# EAGLE design x15 (EAGLE 7.7.0)
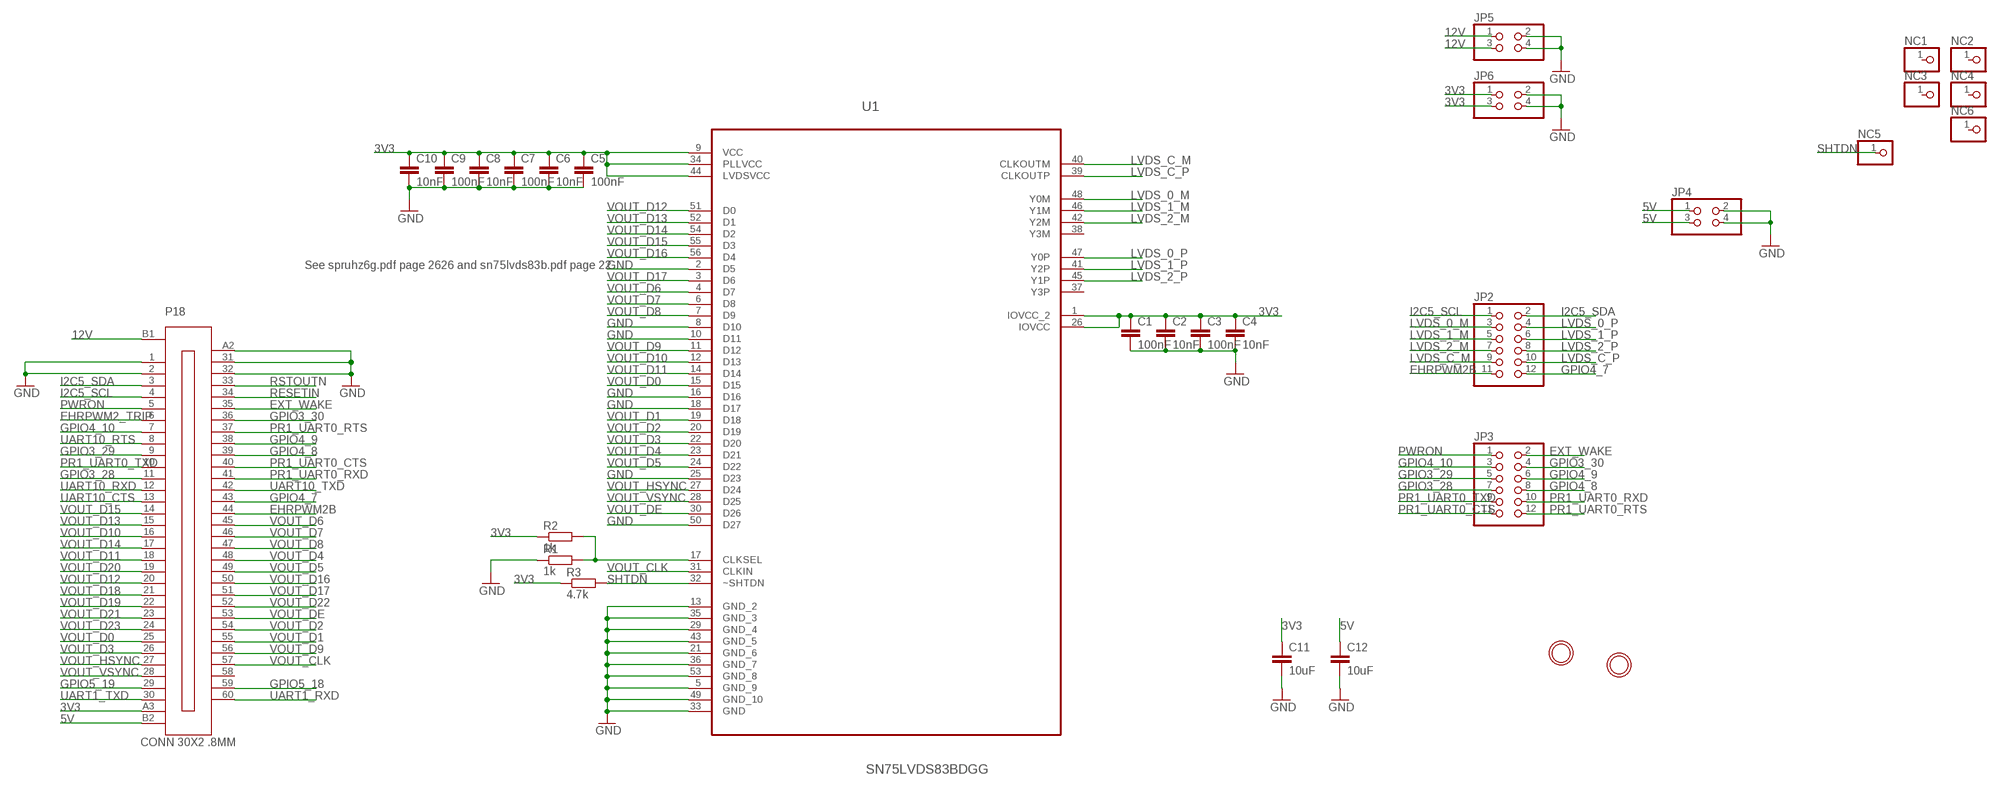
[diagram p0: schematic, sheet 1]

## Parts
C1  100nF  C-EUC0603K  [C0603K]
C2  10nF  C-EUC0603K  [C0603K]
C3  100nF  C-EUC0603K  [C0603K]
C4  10nF  C-EUC0603K  [C0603K]
C5  100nF  C-EUC0603K  [C0603K]
C6  10nF  C-EUC0603K  [C0603K]
C7  100nF  C-EUC0603K  [C0603K]
C8  10nF  C-EUC0603K  [C0603K]
C9  100nF  C-EUC0603K  [C0603K]
C10  10nF  C-EUC0603K  [C0603K]
C11  10uF  C-EUC1206K  [C1206K]
C12  10uF  C-EUC1206K  [C1206K]
JP2  PINHD-2X6  [2X06]
JP3  PINHD-2X6  [2X06]
JP4  PINHD-2X2  [2X02]
JP5  PINHD-2X2  [2X02]
JP6  PINHD-2X2  [2X02]
NC1  PINHD-1X1  [1X01]
NC2  PINHD-1X1  [1X01]
NC3  PINHD-1X1  [1X01]
NC4  PINHD-1X1  [1X01]
NC5  PINHD-1X1  [1X01]
NC6  PINHD-1X1  [1X01]
P18  CONN 30X2 .8MM  CONN_FX18-60S-0.8SV15  [CONN_FX18-60S-0.8SV15]
R1  1k  R-EU_R0603  [R0603]
R2  1k  R-EU_R0603  [R0603]
R3  4.7k  R-EU_R0603  [R0603]
U1  SN75LVDS83BDGG  [SOP50P810X120-56N]
U$1  MOUNTINGHOLE2.5  [MOUNTINGHOLE_2.5_PLATED]
U$2  MOUNTINGHOLE2.5  [MOUNTINGHOLE_2.5_PLATED]

## Nets
3V3: C1.1 C2.1 C3.1 C4.1 C5.1 C6.1 C7.1 C8.1 C9.1 C10.1 C11.1 JP6.1 JP6.3 P18.A3 R2.1 R3.1 U1.1(IOVCC_2) U1.9(VCC) U1.26(IOVCC) U1.34(PLLVCC) U1.44(LVDSVCC)
5V: C12.1 JP4.1 JP4.3 P18.B2
12V: JP5.1 JP5.3 P18.B1
EHRPWM2_TRIP: P18.6
EHRPWM2B: JP2.11 P18.44
EXT_WAKE: JP3.2 P18.35
GND: C1.2 C2.2 C3.2 C4.2 C5.2 C6.2 C7.2 C8.2 C9.2 C10.2 C11.2 C12.2 JP4.2 JP4.4 JP5.2 JP5.4 JP6.2 JP6.4 P18.1 P18.2 P18.31 P18.32 P18.A2 R1.1 U1.2(D5) U1.5(GND_9) U1.8(D10) U1.10(D11) U1.13(GND_2) U1.16(D16) U1.18(D17) U1.21(GND_6) U1.25(D23) U1.29(GND_4) U1.33(GND) U1.35(GND_3) U1.36(GND_7) U1.43(GND_5) U1.49(GND_10) U1.50(D27) U1.53(GND_8)
GPIO3_28: JP3.7 P18.11
GPIO3_29: JP3.5 P18.9
GPIO3_30: JP3.4 P18.36
GPIO4_7: JP2.12 P18.43
GPIO4_8: JP3.8 P18.39
GPIO4_9: JP3.6 P18.38
GPIO4_10: JP3.3 P18.7
GPIO5_18: P18.59
GPIO5_19: P18.29
I2C5_SCL: JP2.1 P18.4
I2C5_SDA: JP2.2 P18.3
LVDS_0_M: JP2.3 U1.48(Y0M)
LVDS_0_P: JP2.4 U1.47(Y0P)
LVDS_1_M: JP2.5 U1.46(Y1M)
LVDS_1_P: JP2.6 U1.41(Y2P)
LVDS_2_M: JP2.7 U1.42(Y2M)
LVDS_2_P: JP2.8 U1.45(Y1P)
LVDS_C_M: JP2.9 U1.40(CLKOUTM)
LVDS_C_P: JP2.10 U1.39(CLKOUTP)
N$2: R1.2 R2.2 U1.17(CLKSEL)
PR1_UART0_CTS: JP3.11 P18.40
PR1_UART0_RTS: JP3.12 P18.37
PR1_UART0_RXD: JP3.10 P18.41
PR1_UART0_TXD: JP3.9 P18.10
PWRON: JP3.1 P18.5
RESETIN: P18.34
RSTOUTN: P18.33
SHTDN: NC5.1 R3.2 U1.32(~SHTDN)
UART1_RXD: P18.60
UART1_TXD: P18.30
UART10_CTS: P18.13
UART10_RTS: P18.8
UART10_RXD: P18.12
UART10_TXD: P18.42
VOUT_CLK: P18.57 U1.31(CLKIN)
VOUT_D0: P18.25 U1.15(D15)
VOUT_D1: P18.55 U1.19(D18)
VOUT_D2: P18.54 U1.20(D19)
VOUT_D3: P18.26 U1.22(D20)
VOUT_D4: P18.48 U1.23(D21)
VOUT_D5: P18.49 U1.24(D22)
VOUT_D6: P18.45 U1.4(D7)
VOUT_D7: P18.46 U1.6(D8)
VOUT_D8: P18.47 U1.7(D9)
VOUT_D9: P18.56 U1.11(D12)
VOUT_D10: P18.16 U1.12(D13)
VOUT_D11: P18.18 U1.14(D14)
VOUT_D12: P18.20 U1.51(D0)
VOUT_D13: P18.15 U1.52(D1)
VOUT_D14: P18.17 U1.54(D2)
VOUT_D15: P18.14 U1.55(D3)
VOUT_D16: P18.50 U1.56(D4)
VOUT_D17: P18.51 U1.3(D6)
VOUT_D18: P18.21
VOUT_D19: P18.22
VOUT_D20: P18.19
VOUT_D21: P18.23
VOUT_D22: P18.52
VOUT_D23: P18.24
VOUT_DE: P18.53 U1.30(D26)
VOUT_HSYNC: P18.27 U1.27(D24)
VOUT_VSYNC: P18.28 U1.28(D25)
Unconnected: NC1.1 NC2.1 NC3.1 NC4.1 NC6.1 P18.58 U1.37(Y3P) U1.38(Y3M)

## Notes on the sheet
- See spruhz6g.pdf page 2626 and sn75lvds83b.pdf page 22

## Library data of the parts
C1-C12 = rcl:C-EU: CAPACITOR, European symbol
JP2 JP3 = pinhead:PINHD-2X6: PIN HEADER
JP4-JP6 = pinhead:PINHD-2X2: PIN HEADER
NC1-NC6 = pinhead:PINHD-1X1: PIN HEADER
P18 = TI_AM572x_CM_RevA2_LIB:CONN_FX18-60?-0.8*; CCO: 158-0005480; DESCRIPTION: 60 POS 0.8MM VERT SV-15 TYPE; MAN: HIROSE; MAN_PN: FX18-60S-0.8SV15
R1-R3 = rcl:R-EU_: RESISTOR, European symbol
U1 = Texas Instruments_By_element14_Batch_1:SN75LVDS83BDGG: FLATLINK? TRANSMITTER; MPN: SN75LVDS83BDGG; OC_FARNELL: 1786537; OC_NEWARK: 11R7398; PACKAGE: TSSOP-56; SUPPLIER: Texas Instruments
U$1 U$2 = microbuilder:MOUNTINGHOLE: Mounting Hole For #2 screws (0.086"/2.18mm width, 0.094"/2.4mm hole) use 2.5mm

## Board
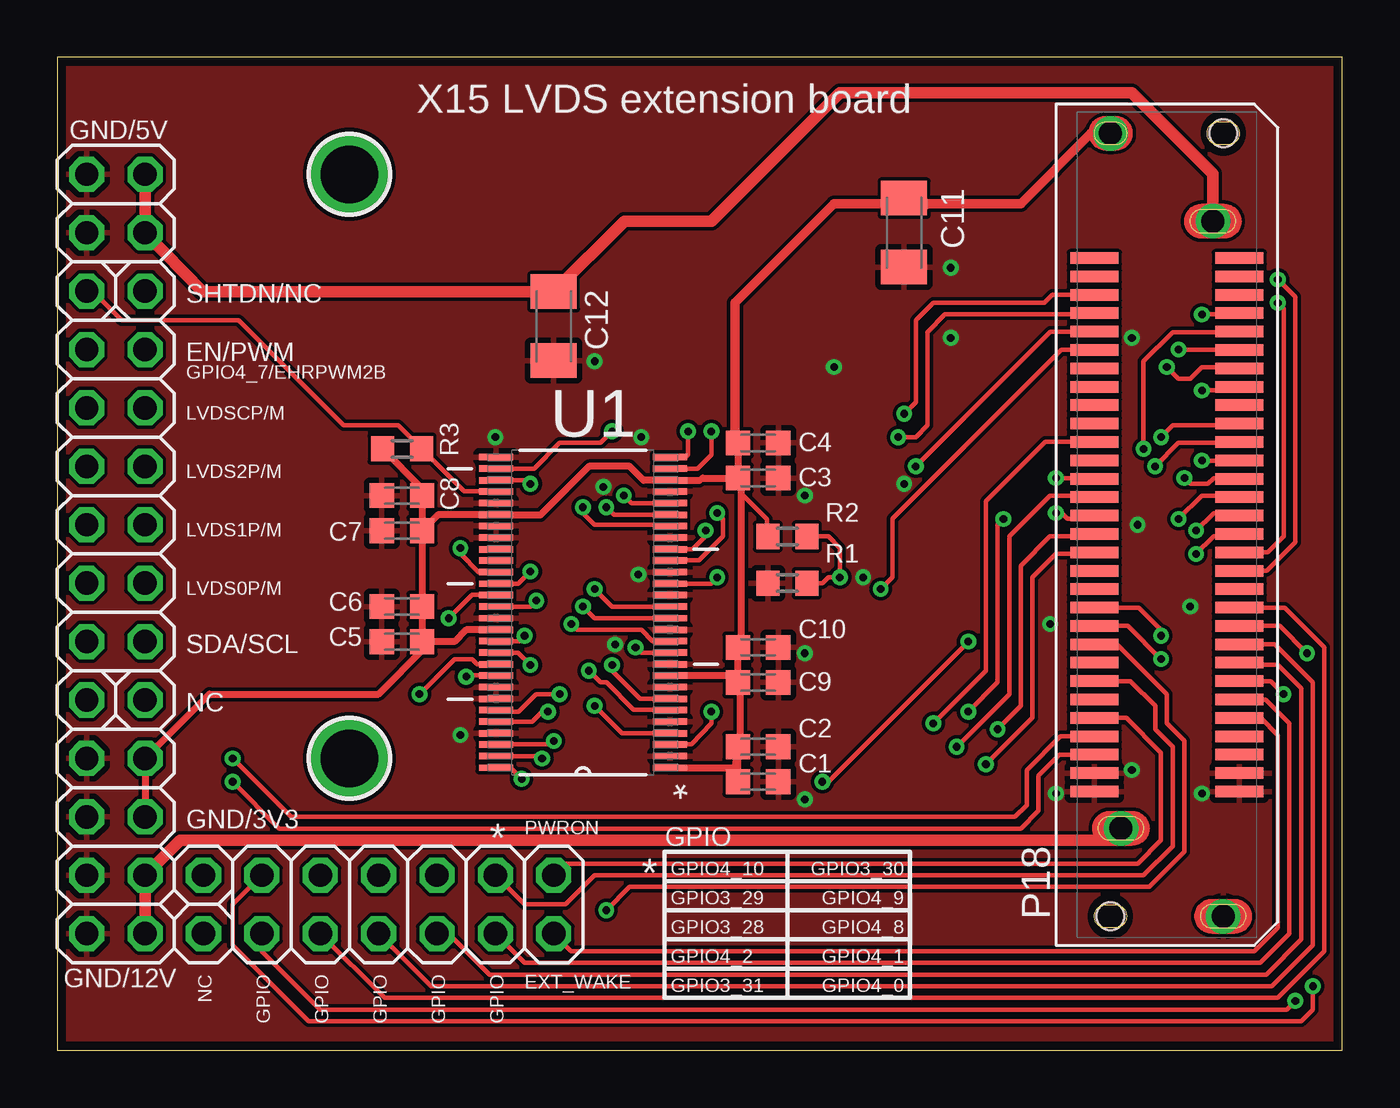
[diagram p1: board, top side]
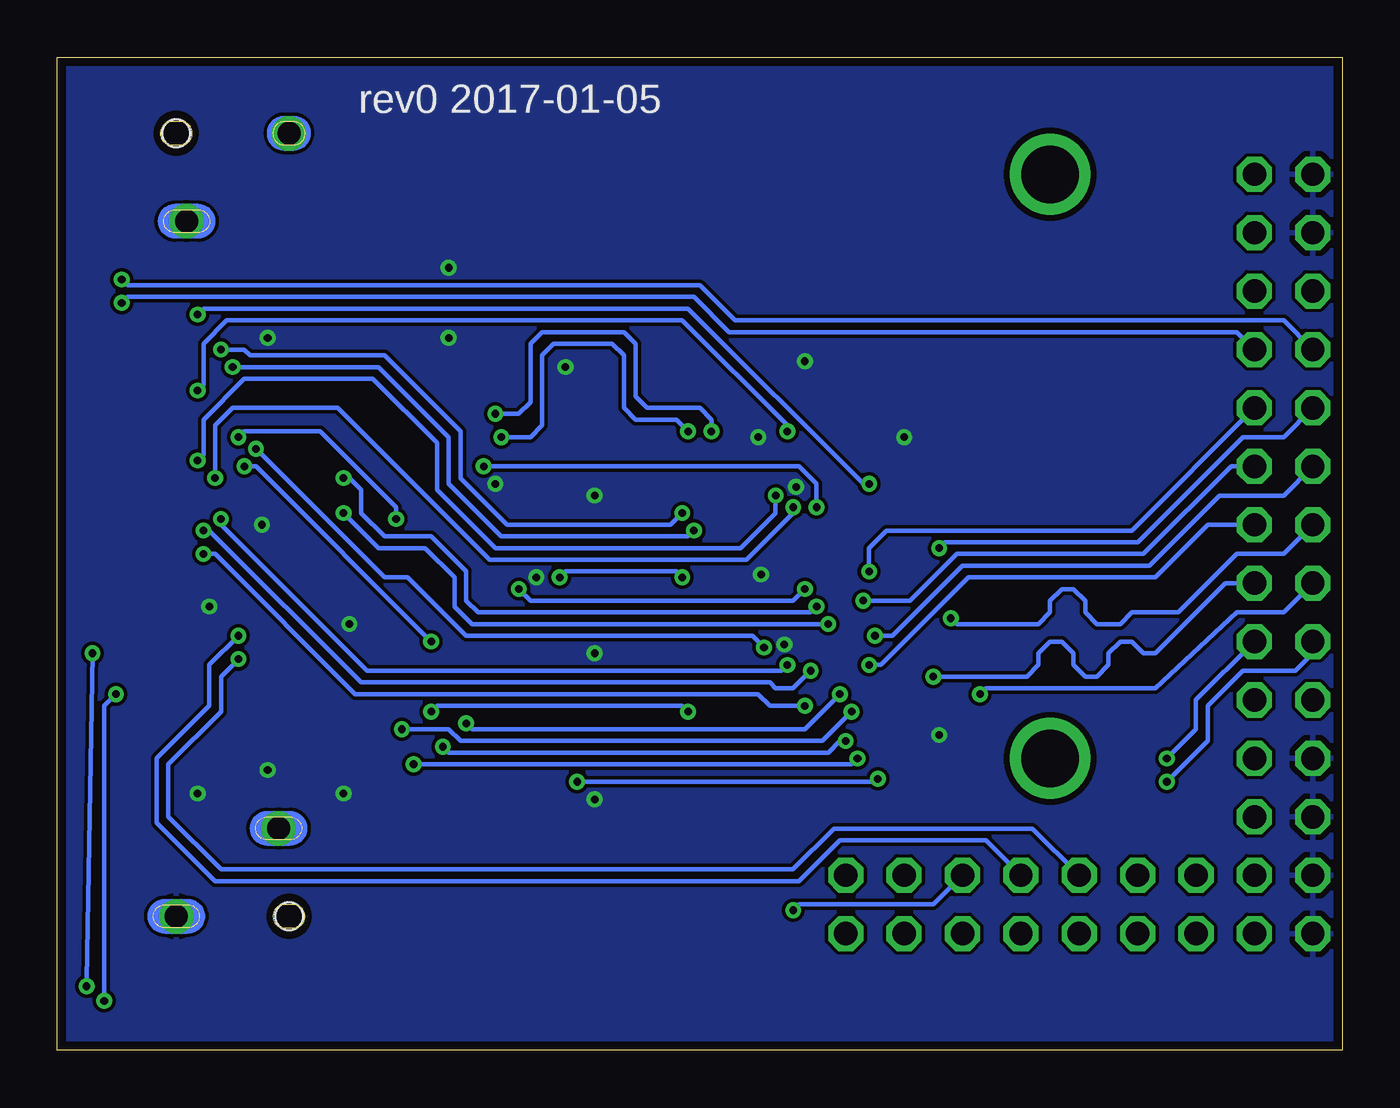
[diagram p2: board, bottom side, seen from below]

Size 55.88 x 43.18 mm. Coordinates in mm from the lower left corner, seen from the top.
Outline: 0,0 55.88,0 55.88,43.18 0,43.18 0,0
Copper layers (1*16): Top 0.0356mm / dielectric 1.5011mm / Bottom 0.0356mm
Design rules "LaenPCBOrder": minimum track width 6mil, minimum drill 13mil, track to track 6mil, track to pad 6mil, pad to pad 6mil, via to via 6mil, smd to smd 6mil, copper to edge 15mil, drill to drill 6mil, minimum pad ring 7mil, minimum via ring 7mil, stop-mask expansion 3mil, vias tented up to drill 0mil, thermal gap 10mil

### Footprints (pad centres in the part's own frame; a part is rotated, then mirrored left to right if it is on the bottom)
C0603K = smd 1.05 x 1.08: 1 -0.875,0; 2 0.875,0
C1206K = smd 1.5 x 2: 1 -1.5,0; 2 1.5,0
2X06 = drill 1.016 octagon: 1 -6.35,-1.27; 2 -6.35,1.27; 3 -3.81,-1.27; 4 -3.81,1.27; 5 -1.27,-1.27; 6 -1.27,1.27; 7 1.27,-1.27; 8 1.27,1.27; 9 3.81,-1.27; 10 3.81,1.27; 11 6.35,-1.27; 12 6.35,1.27
2X02 = drill 1.016 octagon: 1 -1.27,-1.27; 2 -1.27,1.27; 3 1.27,-1.27; 4 1.27,1.27
1X01 = drill 1.016 octagon: 1 0,0
CONN_FX18-60S-0.8SV15 = smd 0.5 x 2.1: 1 11.6,-3.15; 2 10.8,-3.15; 3 10,-3.15; 4 9.2,-3.15; 5 8.4,-3.15; 6 7.6,-3.15; 7 6.8,-3.15; 8 6,-3.15; 9 5.2,-3.15; 10 4.4,-3.15; 11 3.6,-3.15; 12 2.8,-3.15; 13 2,-3.15; 14 1.2,-3.15; 15 0.4,-3.15; 16 -0.4,-3.15; 17 -1.2,-3.15; 18 -2,-3.15; 19 -2.8,-3.15; 20 -3.6,-3.15; 21 -4.4,-3.15; 22 -5.2,-3.15; 23 -6,-3.15; 24 -6.8,-3.15; 25 -7.6,-3.15; 26 -8.4,-3.15; 27 -9.2,-3.15; 28 -10,-3.15; 29 -10.8,-3.15; 30 -11.6,-3.15; 31 11.6,3.15; 32 10.8,3.15; 33 10,3.15; 34 9.2,3.15; 35 8.4,3.15; 36 7.6,3.15; 37 6.8,3.15; 38 6,3.15; 39 5.2,3.15; 40 4.4,3.15; 41 3.6,3.15; 42 2.8,3.15; 43 2,3.15; 44 1.2,3.15; 45 0.4,3.15; 46 -0.4,3.15; 47 -1.2,3.15; 48 -2,3.15; 49 -2.8,3.15; 50 -3.6,3.15; 51 -4.4,3.15; 52 -5.2,3.15; 53 -6,3.15; 54 -6.8,3.15; 55 -7.6,3.15; 56 -8.4,3.15; 57 -9.2,3.15; 58 -10,3.15; 59 -10.8,3.15; 60 -11.6,3.15 | drill 1 pad 1.5: A2 17.025,2.45; A3 -17.025,-2.45; B1 13.2,-2; B2 -13.2,2 | hole 1.2: -17.02,2.45; 17.03,-2.45
R0603 = smd 1 x 1.1: 1 -0.85,0; 2 0.85,0
SOP50P810X120-56N = smd 1.473 x 0.279: 1 -3.785,6.756; 2 -3.785,6.248; 3 -3.785,5.74; 4 -3.785,5.258; 5 -3.785,4.75; 6 -3.785,4.242; 7 -3.785,3.759; 8 -3.785,3.251; 9 -3.785,2.743; 10 -3.785,2.261; 11 -3.785,1.753; 12 -3.785,1.245; 13 -3.785,0.762; 14 -3.785,0.254; 15 -3.785,-0.254; 16 -3.785,-0.762; 17 -3.785,-1.245; 18 -3.785,-1.753; 19 -3.785,-2.261; 20 -3.785,-2.743; 21 -3.785,-3.251; 22 -3.785,-3.759; 23 -3.785,-4.242; 24 -3.785,-4.75; 25 -3.785,-5.258; 26 -3.785,-5.74; 27 -3.785,-6.248; 28 -3.785,-6.756; 29 3.785,-6.756; 30 3.785,-6.248; 31 3.785,-5.74; 32 3.785,-5.258; 33 3.785,-4.75; 34 3.785,-4.242; 35 3.785,-3.759; 36 3.785,-3.251; 37 3.785,-2.743; 38 3.785,-2.261; 39 3.785,-1.753; 40 3.785,-1.245; 41 3.785,-0.762; 42 3.785,-0.254; 43 3.785,0.254; 44 3.785,0.762; 45 3.785,1.245; 46 3.785,1.753; 47 3.785,2.261; 48 3.785,2.743; 49 3.785,3.251; 50 3.785,3.759; 51 3.785,4.242; 52 3.785,4.75; 53 3.785,5.258; 54 3.785,5.74; 55 3.785,6.248; 56 3.785,6.756
MOUNTINGHOLE_2.5_PLATED = drill 2.5 pad 3.2: P$1 0,0

### Placement (x,y rotation side)
C1  30.48,11.68 0 top
C2  30.48,13.21 0 top
C3  30.48,24.89 0 top
C4  30.48,26.42 0 top
C5  14.99,17.78 180 top
C6  14.99,19.3 180 top
C7  14.99,22.61 180 top
C8  14.99,24.13 180 top
C9  30.48,16 0 top
C10  30.48,17.53 0 top
C11  36.83,35.56 270 top
C12  21.59,31.5 270 top
JP2  2.54,24.13 90 top
JP3  15.24,6.35 180 top
JP4  2.54,36.83 90 top
JP5  2.54,6.35 90 top
JP6  2.54,11.43 90 top
NC1  6.35,5.08 0 top
NC2  6.35,7.62 0 top
NC3  1.27,15.24 0 top
NC4  3.81,15.24 0 top
NC5  1.27,33.02 0 top
NC6  3.81,33.02 0 top
P18  48.26,22.86 270 top
R1  31.75,20.32 0 top
R2  31.75,22.35 0 top
R3  14.99,26.16 0 top
U1  22.86,19.05 180 top
U$1  12.7,12.7 0 top
U$2  12.7,38.1 0 top

### Tracks (layer width: path | path; a pad name or v marks a point on that pad's centre or on a via)
3V3
  Top 0.203: R2.1 30.88,22.35 30.88,23.1 29.72,24.26 29.73,24.51
  Top 0.305: U1.1 29.5,12.29 C2.1 | C1.1 C2.1 | C9.1 C10.1 29.46,17.53 29.73,17.79 29.73,24.51 C3.1 | C3.1 C4.1 29.46,26.3 | U1.9 29.4,16.31 C9.1 | 29.5,24.79 C3.1 | R3.1 15.86,24.44 C8.1 C7.1 | C7.1 C6.1 C5.1 | C7.1 16.55,23.29 U1.34 21.01,23.29 23.11,25.4 24.89,25.4 25.5,24.79 U1.26 27.91,24.79 28.07,24.89 C3.1 | U1.44 17.78,18.29 17.27,17.78 C5.1 | C5.1 16,17.64 16,17.53 13.97,15.49 6.6,15.49 JP6.3 JP6.1 | C2.1 29.35,13.35 29.72,13.72 29.72,15.89 C9.1
  Top 0.406: 29.46,26.3 29.46,32.51 33.78,36.83 37.85,36.83 | 37.85,36.83 41.91,36.83 44.96,39.88 P18.A3 | C11.1 37.82,36.81 37.85,36.83
5V
  Top 0.508: P18.B2 50.26,38.13 46.74,41.66 34.04,41.66 28.45,36.07 24.66,36.07 C12.1 6.33,33 JP4.1 JP4.3
12V
  Top 0.508: P18.B1 46.23,9.65 45.72,9.14 5.33,9.14 JP5.3 JP5.1
EHRPWM2B  (via drill 0.33)
  Top 0.203: P18.44 52.65,21.66 53.34,22.35 53.34,32.26 v53.09,32.51
  Bottom 0.203: v53.09,32.51 52.83,32.77 28.19,32.77 26.67,31.24 4.57,31.24 JP2.11
EXT_WAKE
  Top 0.203: P18.35 52.34,14.46 53.09,13.72 53.09,5.33 52.07,4.32 22.35,4.32 JP3.2
GND  (via drill 0.33)
  other vias: 24.26,17.65 35.05,20.57 32.51,17.27 23.37,29.97 46.74,12.19 25.4,26.67 38.86,34.04 17.53,13.72 49.78,11.18 33.78,29.72 43.18,18.54 23.75,24.51 38.86,30.99 36.83,24.64 43.43,11.18 46.99,22.86 49.28,19.3 32.51,10.92 25.27,20.7 32.51,24.13 19.05,26.67 46.74,30.99
  pour Bottom: -5.08,-5.08 81.28,-5.08 81.28,55.88 -5.08,55.88
  pour Top: -10.16,-10.16 86.36,-10.16 86.36,60.96 -10.16,60.96
GPIO3_28  (via drill 0.33)
  Top 0.203: P18.11 47.03,19.26 48.01,18.29 v48.01,18.03
  Bottom 0.203: v48.01,18.03 49.28,16.76 49.28,14.99 51.56,12.7 51.56,9.91 49.02,7.37 23.62,7.37 21.84,9.14 15.49,9.14 JP3.7
GPIO3_29  (via drill 0.33)
  Top 0.203: P18.9 46.09,17.66 48.26,15.49 48.26,14.22 49.02,13.46 49.02,8.64 47.5,7.11 24.89,7.11 v23.88,6.1
  Bottom 0.203: v23.88,6.1 23.62,6.35 17.78,6.35 JP3.5
GPIO3_30
  Top 0.203: P18.36 52.56,15.26 53.59,14.22 53.59,5.08 52.32,3.81 20.32,3.81 JP3.4
GPIO4_7  (via drill 0.33)
  Top 0.203: P18.43 52.61,20.86 53.85,22.1 53.85,32.77 v53.09,33.53
  Bottom 0.203: v53.09,33.53 52.83,33.27 27.94,33.27 26.42,31.75 2.54,31.75 JP2.12
GPIO4_8
  Top 0.203: P18.39 52.95,17.66 54.61,16 54.61,4.57 52.83,2.79 16.26,2.79 JP3.8
GPIO4_9
  Top 0.203: JP3.6 17.02,5.08 18.8,3.3 52.58,3.3 54.1,4.83 54.1,15.75 53.09,16.76 51.51,16.76 P18.38
GPIO4_10
  Top 0.203: P18.7 46.68,16.06 47.75,14.99 47.75,13.97 48.51,13.21 48.51,8.89 47.24,7.62 23.37,7.62 22.1,6.35 20.32,6.35 JP3.3
I2C5_SCL  (via drill 0.33)
  Top 0.203: P18.4 43.63,13.66 42.16,12.19 42.16,10.67 41.66,10.16 10.16,10.16 v7.62,12.7
  Bottom 0.203: v7.62,12.7 6.35,13.97 6.35,15.24 JP2.1
I2C5_SDA  (via drill 0.33)
  Top 0.203: P18.3 43.59,12.86 42.67,11.94 42.67,10.41 41.91,9.65 9.65,9.65 v7.62,11.68
  Bottom 0.203: v7.62,11.68 5.84,13.46 5.84,14.99 4.32,16.51 2.03,16.51 1.27,17.27 JP2.2
LVDS_0_M  (via drill 0.33)
  Top 0.203: U1.48 17.83,16.31 v17.78,16.26
  Bottom 0.203: v17.78,16.26 13.72,16.26 13.21,16.76 13.21,17.27 12.7,17.78 12.19,17.78 11.68,17.27 11.68,16.76 11.18,16.26 10.67,16.26 10.16,16.76 10.16,17.27 9.65,17.78 9.14,17.78 8.64,17.27 8.13,17.27 5.08,20.32 JP2.3
LVDS_0_P  (via drill 0.33)
  Top 0.203: U1.47 18.26,16.79 18.03,17.02 17.27,17.02 v15.75,15.49
  Bottom 0.203: v15.75,15.49 15.49,15.75 8.13,15.75 4.57,19.05 2.54,19.05 JP2.4
LVDS_1_M  (via drill 0.33)
  Top 0.203: U1.46 20.04,17.3 v20.57,16.76
  Bottom 0.203: v20.57,16.76 20.07,16.76 16.26,20.57 8.13,20.57 5.84,22.86 JP2.5
LVDS_1_P  (via drill 0.33)
  Top 0.203: U1.41 18.03,19.81 v17.02,18.8
  Bottom 0.203: v17.02,18.8 16.76,18.54 13.21,18.54 12.7,19.05 12.7,19.56 12.19,20.07 11.68,20.07 11.18,19.56 11.18,19.05 10.67,18.54 9.65,18.54 9.14,19.05 7.11,19.05 4.57,21.59 2.54,21.59 JP2.6
LVDS_2_M  (via drill 0.33)
  Top 0.203: U1.42 20.57,19.3 v20.83,19.56
  Bottom 0.203: v20.83,19.56 18.8,19.56 16.76,21.59 8.64,21.59 4.83,25.4 JP2.7
LVDS_2_P  (via drill 0.33)
  Top 0.203: U1.45 20.09,17.8 v20.32,18.03
  Bottom 0.203: v20.32,18.03 19.56,18.03 16.51,21.08 8.38,21.08 5.33,24.13 2.54,24.13 JP2.8
LVDS_C_M  (via drill 0.33)
  Top 0.203: U1.40 20.04,20.3 v20.57,20.83
  Bottom 0.203: v20.57,20.83 20.57,21.84 19.81,22.61 9.14,22.61 JP2.9
LVDS_C_P  (via drill 0.33)
  Top 0.203: U1.39 18.31,20.8 17.53,21.59 v17.53,21.84
  Bottom 0.203: v17.53,21.84 17.27,22.1 8.89,22.1 4.32,26.67 2.54,26.67 JP2.10
N$2  (via drill 0.33)
  Top 0.203: U1.17 28.42,20.3 v28.7,20.57 | R1.2 33.27,20.32 33.53,20.57 v34.04,20.57 34.04,21.84 33.53,22.35 R2.2
  Bottom 0.203: v28.7,20.57 28.96,20.83 33.78,20.83 v34.04,20.57
PR1_UART0_CTS  (via drill 0.33)
  Top 0.203: P18.40 53.17,18.46 v54.36,17.27 | v54.61,2.79 54.61,1.78 54.1,1.27 10.92,1.27 7.62,4.57 7.62,6.35 JP3.11
  Bottom 0.203: v54.36,17.27 54.61,3.05 v54.61,2.79
PR1_UART0_RTS  (via drill 0.33)
  Top 0.203: P18.37 52.77,16.06 v53.34,15.49 | v53.85,2.16 53.47,1.78 11.43,1.78 8.89,4.32 JP3.12
  Bottom 0.203: v53.34,15.49 53.85,14.99 v53.85,2.16
PR1_UART0_RXD
  Top 0.203: P18.41 53.38,19.26 55.12,17.53 55.12,4.32 53.09,2.29 14.22,2.29 JP3.10
PR1_UART0_TXD  (via drill 0.33)
  Top 0.203: P18.10 46.56,18.46 v48.01,17.02
  Bottom 0.203: v48.01,17.02 48.77,16.26 48.77,14.73 51.05,12.45 51.05,10.16 48.77,7.87 23.88,7.87 22.1,9.65 13.46,9.65 JP3.9
PWRON
  Top 0.203: P18.5 46.5,14.46 48.01,12.95 48.01,9.14 46.99,8.13 22.1,8.13 JP3.1
SHTDN
  Top 0.203: U1.32 17.69,24.31 R3.2 14.82,27.18 12.45,27.18 7.87,31.75 2.79,31.75 1.52,33.02 NC5.1
VOUT_CLK  (via drill 0.33)
  Top 0.203: U1.31 20.47,24.79 v20.57,24.64 | v49.78,32 51.35,32 P18.57
  Bottom 0.203: v20.57,24.64 20.83,24.64 28.45,32.26 49.53,32.26 v49.78,32
VOUT_D0  (via drill 0.33)
  Top 0.203: P18.25 43.67,30.46 36.32,23.11 36.32,20.57 v35.81,20.07 | v23.37,20.07 24.13,19.3 U1.15
  Bottom 0.203: v35.81,20.07 35.31,19.56 23.88,19.56 v23.37,20.07
VOUT_D1  (via drill 0.33)
  Top 0.203: U1.19 27.91,21.31 28.96,22.35 28.96,23.11 v28.7,23.37 | v48.77,30.48 51.39,30.48 P18.55
  Bottom 0.203: v28.7,23.37 29.21,22.86 36.32,22.86 38.35,24.89 38.35,26.92 41.66,30.23 47.5,30.23 47.75,30.48 v48.77,30.48
VOUT_D2  (via drill 0.33)
  Top 0.203: v48.26,29.72 48.77,29.21 49.28,29.21 49.78,29.72 51.35,29.72 P18.54 | U1.20 27.64,21.79 28.19,22.35 v28.19,22.61
  Bottom 0.203: v28.19,22.61 28.45,22.35 36.58,22.35 38.86,24.64 38.86,26.67 41.91,29.72 v48.26,29.72
VOUT_D3  (via drill 0.33)
  Top 0.203: P18.26 43.42,31.26 | 43.42,31.26 43.2,31.26 43.18,31.24 | 43.42,31.26 43.18,31.24 | 43.18,31.24 v37.34,25.4 | v22.86,23.62 22.86,23.37 23.37,22.86 26.44,22.86 U1.22
  Bottom 0.203: v37.34,25.4 23.62,25.4 22.86,24.64 v22.86,23.62
VOUT_D4  (via drill 0.33)
  Top 0.203: U1.23 24.21,23.29 v23.88,23.62 | v49.02,24.89 49.28,24.64 50.04,24.64 50.29,24.89 51.38,24.89 P18.48
  Bottom 0.203: v49.02,24.89 49.02,27.18 48.26,27.94 43.69,27.94 37.08,21.34 25.91,21.34 23.88,23.37 v23.88,23.62
VOUT_D5  (via drill 0.33)
  Top 0.203: U1.24 24.97,23.8 v24.64,24.13 | v49.78,25.65 P18.49
  Bottom 0.203: v49.78,25.65 49.53,25.91 49.53,27.43 47.75,29.21 42.16,29.21 39.37,26.42 39.37,24.38 36.83,21.84 26.16,21.84 24.64,23.37 v24.64,24.13
VOUT_D6  (via drill 0.33)
  Top 0.203: U1.4 24.56,13.79 v23.37,14.99 | v49.53,21.59 50.29,22.35 51.3,22.35 P18.45
  Bottom 0.203: v23.37,14.99 24.89,14.99 25.4,15.49 42.93,15.49 49.02,21.59 v49.53,21.59
VOUT_D7  (via drill 0.33)
  Top 0.203: U1.6 25.07,14.81 23.88,16 23.62,16 v23.11,16.51 | v49.53,22.61 50.29,23.37 51.3,23.37 P18.46
  Bottom 0.203: v23.11,16.51 23.88,15.75 24.64,15.75 24.89,16 42.67,16 49.28,22.61 v49.53,22.61
VOUT_D8  (via drill 0.33)
  Top 0.203: U1.7 25.35,15.29 24.38,16.26 24.13,16.51 v24.13,16.76 | v48.77,23.11 49.78,24.13 51.34,24.13 P18.47
  Bottom 0.203: v24.13,16.76 24.38,16.51 42.42,16.51 48.77,22.86 v48.77,23.11
VOUT_D9  (via drill 0.33)
  Top 0.203: U1.11 25.38,17.3 v25.15,17.53 | v47.24,26.16 47.24,29.97 48.51,31.24 51.39,31.24 P18.56
  Bottom 0.203: v25.15,17.53 25.65,18.03 38.1,18.03 40.64,20.57 41.66,20.57 v47.24,26.16
VOUT_D10  (via drill 0.33)
  Top 0.203: U1.12 25.88,17.8 25.4,18.29 22.61,18.29 v22.35,18.54 | v43.43,23.37 43.69,23.37 43.94,23.11 44.96,23.11 P18.16
  Bottom 0.203: v22.35,18.54 37.85,18.54 38.61,19.3 38.61,20.57 39.88,21.84 41.91,21.84 v43.43,23.37
VOUT_D11  (via drill 0.33)
  Top 0.203: U1.14 23.37,18.8 v22.86,19.3 | v43.43,24.89 45.08,24.89 P18.18
  Bottom 0.203: v22.86,19.3 23.11,19.05 37.59,19.05 38.1,19.56 38.1,20.83 39.62,22.35 41.66,22.35 42.67,23.37 42.67,24.38 43.18,24.89 v43.43,24.89
VOUT_D12  (via drill 0.33)
  Top 0.203: P18.20 42.97,26.46 40.39,23.88 40.39,16.51 v38.1,14.22 | v21.84,15.49 20.83,15.49 20.07,14.73 19.15,14.73 U1.51
  Bottom 0.203: v38.1,14.22 37.85,13.97 23.37,13.97 v21.84,15.49
VOUT_D13  (via drill 0.33)
  Top 0.203: v21.34,14.73 21.08,14.73 20.65,14.3 U1.52 | v40.89,13.97 41.91,14.99 41.91,21.08 43.18,22.35 45,22.35 P18.15
  Bottom 0.203: v21.34,14.73 22.61,13.46 38.35,13.46 38.86,13.97 v40.89,13.97
VOUT_D14  (via drill 0.33)
  Top 0.203: U1.54 21.44,13.31 v21.59,13.46 | v39.12,13.21 41.4,15.49 41.4,22.35 43.18,24.13 45.04,24.13 P18.17
  Bottom 0.203: v21.59,13.46 21.84,13.46 22.35,12.95 38.86,12.95 v39.12,13.21
VOUT_D15  (via drill 0.33)
  Top 0.203: U1.55 20.93,12.8 v21.08,12.7 | v40.39,12.45 42.42,14.48 42.42,20.57 43.43,21.59 45.04,21.59 P18.14
  Bottom 0.203: v21.08,12.7 21.34,12.45 v40.39,12.45
VOUT_D16  (via drill 0.33)
  Top 0.203: U1.56 19.71,12.29 v20.19,11.81 | v47.75,25.4 48.77,26.42 51.37,26.42 P18.50 | v39.62,17.78 33.53,11.68 v33.27,11.68
  Bottom 0.203: v39.62,17.78 47.24,25.4 v47.75,25.4 | v33.27,11.68 20.32,11.68 v20.19,11.81
VOUT_D17  (via drill 0.33)
  Top 0.203: U1.3 27.58,13.31 28.45,14.22 v28.45,14.73 | v48.01,26.67 48.51,27.18 51.33,27.18 P18.51 | v41.15,23.11 40.89,22.86 40.89,16 v39.62,14.73
  Bottom 0.203: v28.45,14.73 28.7,14.99 39.37,14.99 v39.62,14.73 | v41.15,23.11 41.15,23.62 44.45,26.92 47.75,26.92 v48.01,26.67
VOUT_DE  (via drill 0.33)
  Top 0.203: U1.30 20.73,25.3 21.84,26.42 23.62,26.42 v24.13,26.92 | v49.78,28.7 51.25,28.7 P18.53
  Bottom 0.203: v24.13,26.92 24.13,27.18 28.7,31.75 48.51,31.75 49.53,30.73 49.53,28.96 v49.78,28.7
VOUT_HSYNC  (via drill 0.33)
  Top 0.203: P18.27 44.76,32.06 44.7,32 38.61,32 37.85,31.24 37.85,27.18 37.34,26.67 v36.58,26.67 | U1.27 27.84,25.3 28.45,25.91 v28.45,26.92
  Bottom 0.203: v36.58,26.67 35.31,26.67 34.8,27.18 34.8,30.23 34.29,30.73 31.75,30.73 31.24,30.23 31.24,27.94 30.73,27.43 28.96,27.43 v28.45,26.92
VOUT_VSYNC  (via drill 0.33)
  Top 0.203: P18.28 43.27,32.86 42.93,32.51 38.1,32.51 37.34,31.75 37.34,28.19 v36.83,27.69 | U1.28 27.33,25.81 27.43,25.91 v27.43,26.92
  Bottom 0.203: v36.83,27.69 35.81,27.69 35.31,28.19 35.31,30.73 34.8,31.24 31.24,31.24 30.73,30.73 30.73,28.45 30.23,27.94 27.94,27.94 27.43,27.43 v27.43,26.92

### Text on the board
tNames: X15 LVDS extension board | GND/5V | SHTDN/NC | EN/PWM | GPIO4_7/EHRPWM2B | LVDSCP/M | LVDS2P/M | LVDS1P/M | LVDS0P/M | SDA/SCL | NC | GND/3V3 | * | PWRON | GPIO | GPIO4_10 | GPIO3_30 | * | GPIO3_29 | GPIO4_9 | GPIO3_28 | GPIO4_8 | GND/12V | GPIO4_2 | GPIO4_1 | NC | GPIO | GPIO | GPIO | GPIO | GPIO | EXT_WAKE | GPIO3_31 | GPIO4_0
bNames: rev0 2017-01-05